# Altium schematic sheet 2_DDR3L_16bits.SchDoc: 2_DDR3L_16bits
size A3; Date: Not used; ApprovedBy: Not used; CheckedBy: Not used; Author: Not used; CompanyName: STMicroelectronics; DrawnBy: Not used; Engineer: Not used; Organization: Not used; Address1: Not used; Address2: Not used; Address3: Not used; Address4: Not used; DocumentNumber: Not used; Revision: Not used; SheetNumber: 6; SheetTotal: 7; CurrentTime: Not used; CurrentDate: Not used; Time: Not used; DocumentFullPathAndName: Not used; DocumentName: Not used; ModifiedDate: Not used; ImagePath: Not used; ProjectName: Not used; Application_BuildNumber: Not used
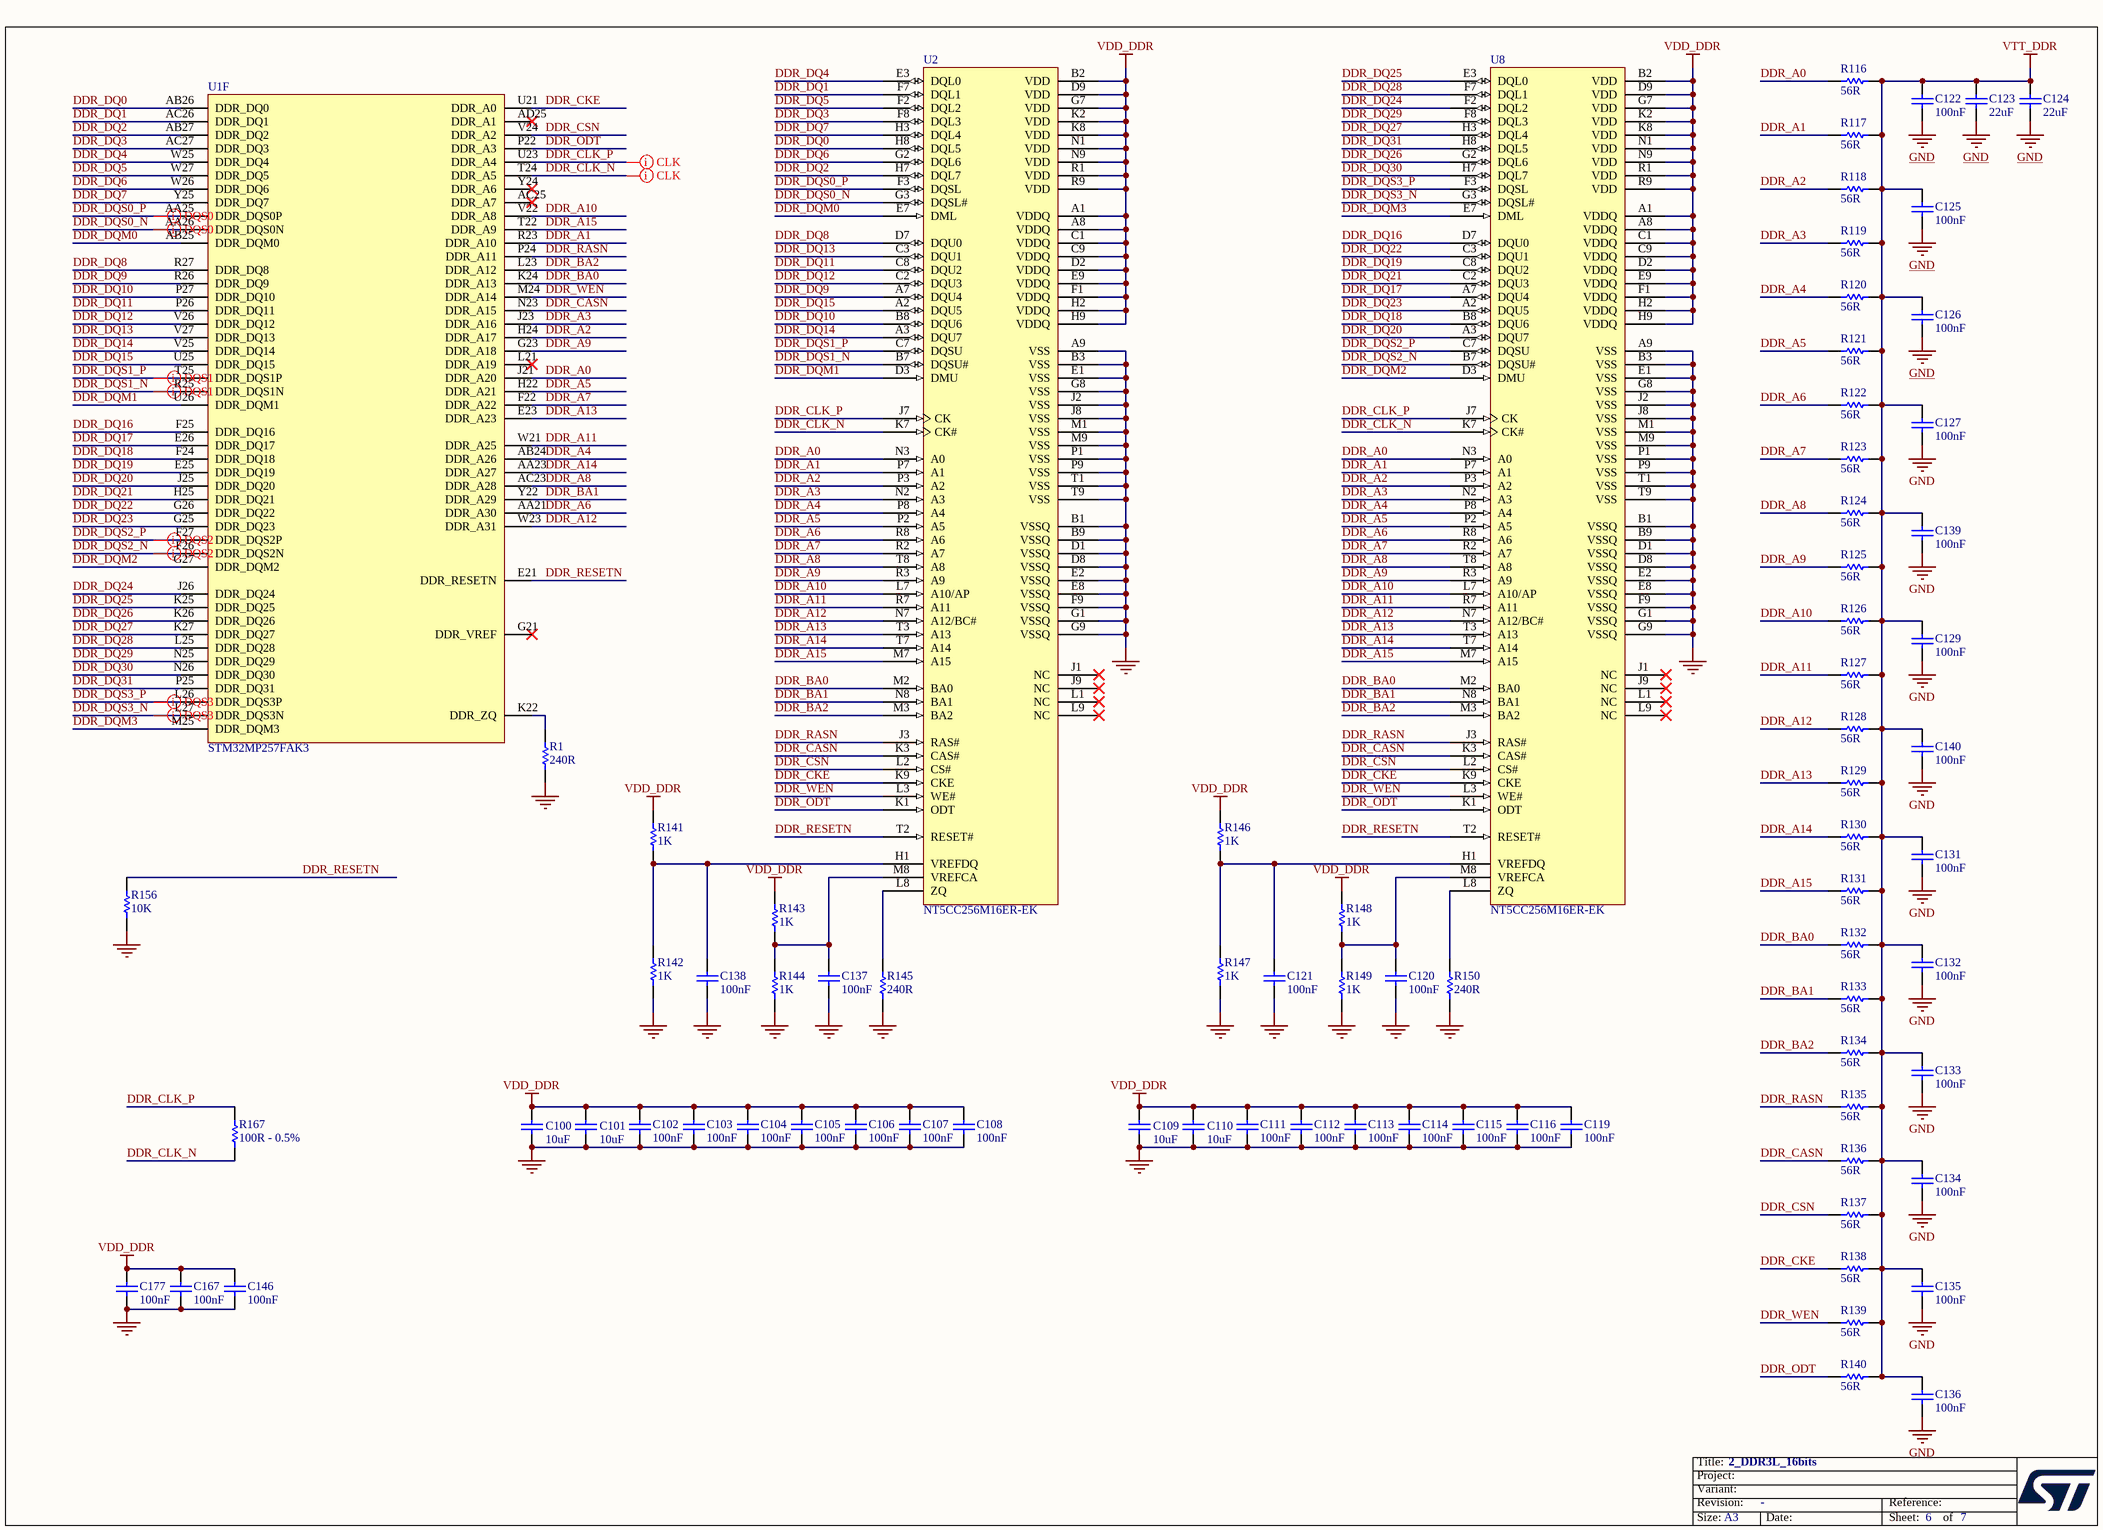
[diagram p0: 2_DDR3L_16bits.SchDoc]

## Parts
C100  value 10uF  [C0603]  (hidden comment: Capacitor)
C101  value 10uF  [C0603]  (hidden comment: Capacitor)
C102  value 100nF  [C0402]  (hidden comment: Capacitor)
C103  value 100nF  [C0402]  (hidden comment: Capacitor)
C104  value 100nF  [C0402]  (hidden comment: Capacitor)
C105  value 100nF  [C0402]  (hidden comment: Capacitor)
C106  value 100nF  [C0402]  (hidden comment: Capacitor)
C107  value 100nF  [C0402]  (hidden comment: Capacitor)
C108  value 100nF  [C0402]  (hidden comment: Capacitor)
C109  value 10uF  [C0603]  (hidden comment: Capacitor)
C110  value 10uF  [C0603]  (hidden comment: Capacitor)
C111  value 100nF  [C0402]  (hidden comment: Capacitor)
C112  value 100nF  [C0402]  (hidden comment: Capacitor)
C113  value 100nF  [C0402]  (hidden comment: Capacitor)
C114  value 100nF  [C0402]  (hidden comment: Capacitor)
C115  value 100nF  [C0402]  (hidden comment: Capacitor)
C116  value 100nF  [C0402]  (hidden comment: Capacitor)
C119  value 100nF  [C0402]  (hidden comment: Capacitor)
C120  value 100nF  [C0402]  (hidden comment: Capacitor)
C121  value 100nF  [C0402]  (hidden comment: Capacitor)
C122  value 100nF  [C0402]  (hidden comment: Capacitor)
C123  value 22uF  [C0603]  (hidden comment: Capacitor)
C124  value 22uF  [C0603]  (hidden comment: Capacitor)
C125  value 100nF  [C0402]  (hidden comment: Capacitor)
C126  value 100nF  [C0402]  (hidden comment: Capacitor)
C127  value 100nF  [C0402]  (hidden comment: Capacitor)
C129  value 100nF  [C0402]  (hidden comment: Capacitor)
C131  value 100nF  [C0402]  (hidden comment: Capacitor)
C132  value 100nF  [C0402]  (hidden comment: Capacitor)
C133  value 100nF  [C0402]  (hidden comment: Capacitor)
C134  value 100nF  [C0402]  (hidden comment: Capacitor)
C135  value 100nF  [C0402]  (hidden comment: Capacitor)
C136  value 100nF  [C0402]  (hidden comment: Capacitor)
C137  value 100nF  [C0402]  (hidden comment: Capacitor)
C138  value 100nF  [C0402]  (hidden comment: Capacitor)
C139  value 100nF  [C0402]  (hidden comment: Capacitor)
C140  value 100nF  [C0402]  (hidden comment: Capacitor)
C146  value 100nF  [C0402]  (hidden comment: Capacitor)
C167  value 100nF  [C0402]  (hidden comment: Capacitor)
C177  value 100nF  [C0402]  (hidden comment: Capacitor)
R1  value 240R  [R0201_H0P23]  (hidden comment: Resistor)
R116  value 56R  [R0402]  (hidden comment: Resistor)
R117  value 56R  [R0402]  (hidden comment: Resistor)
R118  value 56R  [R0402]  (hidden comment: Resistor)
R119  value 56R  [R0402]  (hidden comment: Resistor)
R120  value 56R  [R0402]  (hidden comment: Resistor)
R121  value 56R  [R0402]  (hidden comment: Resistor)
R122  value 56R  [R0402]  (hidden comment: Resistor)
R123  value 56R  [R0402]  (hidden comment: Resistor)
R124  value 56R  [R0402]  (hidden comment: Resistor)
R125  value 56R  [R0402]  (hidden comment: Resistor)
R126  value 56R  [R0402]  (hidden comment: Resistor)
R127  value 56R  [R0402]  (hidden comment: Resistor)
R128  value 56R  [R0402]  (hidden comment: Resistor)
R129  value 56R  [R0402]  (hidden comment: Resistor)
R130  value 56R  [R0402]  (hidden comment: Resistor)
R131  value 56R  [R0402]  (hidden comment: Resistor)
R132  value 56R  [R0402]  (hidden comment: Resistor)
R133  value 56R  [R0402]  (hidden comment: Resistor)
R134  value 56R  [R0402]  (hidden comment: Resistor)
R135  value 56R  [R0402]  (hidden comment: Resistor)
R136  value 56R  [R0402]  (hidden comment: Resistor)
R137  value 56R  [R0402]  (hidden comment: Resistor)
R138  value 56R  [R0402]  (hidden comment: Resistor)
R139  value 56R  [R0402]  (hidden comment: Resistor)
R140  value 56R  [R0402]  (hidden comment: Resistor)
R141  value 1K  [R0402]  (hidden comment: Resistor)
R142  value 1K  [R0402]  (hidden comment: Resistor)
R143  value 1K  [R0402]  (hidden comment: Resistor)
R144  value 1K  [R0402]  (hidden comment: Resistor)
R145  value 240R  [R0402]  (hidden comment: Resistor)
R146  value 1K  [R0402]  (hidden comment: Resistor)
R147  value 1K  [R0402]  (hidden comment: Resistor)
R148  value 1K  [R0402]  (hidden comment: Resistor)
R149  value 1K  [R0402]  (hidden comment: Resistor)
R150  value 240R  [R0402]  (hidden comment: Resistor)
R156  value 10K  [R0402]  (hidden comment: Resistor)
R167  value 100R - 0.5%  [R0402]  (hidden comment: Resistor)
U1  STM32MP257FAK3  [ICC_TFBGA424_14X14_P050_H1P20_CODE-B0A2]  (part F of 9)
U2  NT5CC256M16ER-EK  [ICC_VFBGA96_9x13_P080]
U8  NT5CC256M16ER-EK  [ICC_VFBGA96_9x13_P080]

## Nets
GND: C100.1 C101.1 C102.1 C103.1 C104.1 C105.1 C106.1 C107.1 C108.1 C109.1 C110.1 C111.1 C112.1 C113.1 C114.1 C115.1 C116.1 C119.1 C120.1 C121.1 C122.1 C123.1 C124.1 C125.1 C126.1 C127.1 C129.1 C131.1 C132.1 C133.1 C134.1 C135.1 C136.1 C137.1 C138.1 C139.1 C140.1 C146.1 C167.1 C177.1 R1.1 R142.1 R144.1 R145.1 R147.1 R149.1 R150.1 R156.1 U2.A9(VSS) U2.B1(VSSQ) U2.B3(VSS) U2.B9(VSSQ) U2.D1(VSSQ) U2.D8(VSSQ) U2.E1(VSS) U2.E2(VSSQ) U2.E8(VSSQ) U2.F9(VSSQ) U2.G1(VSSQ) U2.G8(VSS) U2.G9(VSSQ) U2.J2(VSS) U2.J8(VSS) U2.M1(VSS) U2.M9(VSS) U2.P1(VSS) U2.P9(VSS) U2.T1(VSS) U2.T9(VSS) U8.A9(VSS) U8.B1(VSSQ) U8.B3(VSS) U8.B9(VSSQ) U8.D1(VSSQ) U8.D8(VSSQ) U8.E1(VSS) U8.E2(VSSQ) U8.E8(VSSQ) U8.F9(VSSQ) U8.G1(VSSQ) U8.G8(VSS) U8.G9(VSSQ) U8.J2(VSS) U8.J8(VSS) U8.M1(VSS) U8.M9(VSS) U8.P1(VSS) U8.P9(VSS) U8.T1(VSS) U8.T9(VSS)
VDD_DDR: C100.2 C101.2 C102.2 C103.2 C104.2 C105.2 C106.2 C107.2 C108.2 C109.2 C110.2 C111.2 C112.2 C113.2 C114.2 C115.2 C116.2 C119.2 C146.2 C167.2 C177.2 R141.2 R143.2 R146.2 R148.2 U2.A1(VDDQ) U2.A8(VDDQ) U2.B2(VDD) U2.C1(VDDQ) U2.C9(VDDQ) U2.D2(VDDQ) U2.D9(VDD) U2.E9(VDDQ) U2.F1(VDDQ) U2.G7(VDD) U2.H2(VDDQ) U2.H9(VDDQ) U2.K2(VDD) U2.K8(VDD) U2.N1(VDD) U2.N9(VDD) U2.R1(VDD) U2.R9(VDD) U8.A1(VDDQ) U8.A8(VDDQ) U8.B2(VDD) U8.C1(VDDQ) U8.C9(VDDQ) U8.D2(VDDQ) U8.D9(VDD) U8.E9(VDDQ) U8.F1(VDDQ) U8.G7(VDD) U8.H2(VDDQ) U8.H9(VDDQ) U8.K2(VDD) U8.K8(VDD) U8.N1(VDD) U8.N9(VDD) U8.R1(VDD) U8.R9(VDD)
VTT_DDR: C122.2 C123.2 C124.2 C125.2 C126.2 C127.2 C129.2 C131.2 C132.2 C133.2 C134.2 C135.2 C136.2 C139.2 C140.2 R116.2 R117.2 R118.2 R119.2 R120.2 R121.2 R122.2 R123.2 R124.2 R125.2 R126.2 R127.2 R128.2 R129.2 R130.2 R131.2 R132.2 R133.2 R134.2 R135.2 R136.2 R137.2 R138.2 R139.2 R140.2
DDR_A0: R116.1 U1.J21(DDR_A20) U2.N3(A0) U8.N3(A0)
DDR_A1: R117.1 U1.R23(DDR_A10) U2.P7(A1) U8.P7(A1)
DDR_A2: R118.1 U1.H24(DDR_A17) U2.P3(A2) U8.P3(A2)
DDR_A3: R119.1 U1.J23(DDR_A16) U2.N2(A3) U8.N2(A3)
DDR_A4: R120.1 U1.AB24(DDR_A26) U2.P8(A4) U8.P8(A4)
DDR_A5: R121.1 U1.H22(DDR_A21) U2.P2(A5) U8.P2(A5)
DDR_A6: R122.1 U1.AA21(DDR_A30) U2.R8(A6) U8.R8(A6)
DDR_A7: R123.1 U1.F22(DDR_A22) U2.R2(A7) U8.R2(A7)
DDR_A8: R124.1 U1.AC23(DDR_A28) U2.T8(A8) U8.T8(A8)
DDR_A9: R125.1 U1.G23(DDR_A18) U2.R3(A9) U8.R3(A9)
DDR_A10: R126.1 U1.V22(DDR_A8) U2.L7(A10/AP) U8.L7(A10/AP)
DDR_A11: R127.1 U1.W21(DDR_A25) U2.R7(A11) U8.R7(A11)
DDR_A12: R128.1 U1.W23(DDR_A31) U2.N7(A12/BC#) U8.N7(A12/BC#)
DDR_A13: R129.1 U1.E23(DDR_A23) U2.T3(A13) U8.T3(A13)
DDR_A14: R130.1 U1.AA23(DDR_A27) U2.T7(A14) U8.T7(A14)
DDR_A15: R131.1 U1.T22(DDR_A9) U2.M7(A15) U8.M7(A15)
DDR_BA0: R132.1 U1.K24(DDR_A13) U2.M2(BA0) U8.M2(BA0)
DDR_BA1: R133.1 U1.Y22(DDR_A29) U2.N8(BA1) U8.N8(BA1)
DDR_BA2: R134.1 U1.L23(DDR_A12) U2.M3(BA2) U8.M3(BA2)
DDR_CASN: R136.1 U1.N23(DDR_A15) U2.K3(CAS#) U8.K3(CAS#)
DDR_CKE: R138.1 U1.U21(DDR_A0) U2.K9(CKE) U8.K9(CKE)
DDR_CLK_N: R167.2 U1.T24(DDR_A5) U2.K7(CK#) U8.K7(CK#)
DDR_CLK_P: R167.1 U1.U23(DDR_A4) U2.J7(CK) U8.J7(CK)
DDR_CSN: R137.1 U1.V24(DDR_A2) U2.L2(CS#) U8.L2(CS#)
DDR_DQ0: U1.AB26(DDR_DQ0) U2.H8(DQL5)
DDR_DQ1: U1.AC26(DDR_DQ1) U2.F7(DQL1)
DDR_DQ2: U1.AB27(DDR_DQ2) U2.H7(DQL7)
DDR_DQ3: U1.AC27(DDR_DQ3) U2.F8(DQL3)
DDR_DQ4: U1.W25(DDR_DQ4) U2.E3(DQL0)
DDR_DQ5: U1.W27(DDR_DQ5) U2.F2(DQL2)
DDR_DQ6: U1.W26(DDR_DQ6) U2.G2(DQL6)
DDR_DQ7: U1.Y25(DDR_DQ7) U2.H3(DQL4)
DDR_DQ8: U1.R27(DDR_DQ8) U2.D7(DQU0)
DDR_DQ9: U1.R26(DDR_DQ9) U2.A7(DQU4)
DDR_DQ10: U1.P27(DDR_DQ10) U2.B8(DQU6)
DDR_DQ11: U1.P26(DDR_DQ11) U2.C8(DQU2)
DDR_DQ12: U1.V26(DDR_DQ12) U2.C2(DQU3)
DDR_DQ13: U1.V27(DDR_DQ13) U2.C3(DQU1)
DDR_DQ14: U1.V25(DDR_DQ14) U2.A3(DQU7)
DDR_DQ15: U1.U25(DDR_DQ15) U2.A2(DQU5)
DDR_DQ16: U1.F25(DDR_DQ16) U8.D7(DQU0)
DDR_DQ17: U1.E26(DDR_DQ17) U8.A7(DQU4)
DDR_DQ18: U1.F24(DDR_DQ18) U8.B8(DQU6)
DDR_DQ19: U1.E25(DDR_DQ19) U8.C8(DQU2)
DDR_DQ20: U1.J25(DDR_DQ20) U8.A3(DQU7)
DDR_DQ21: U1.H25(DDR_DQ21) U8.C2(DQU3)
DDR_DQ22: U1.G26(DDR_DQ22) U8.C3(DQU1)
DDR_DQ23: U1.G25(DDR_DQ23) U8.A2(DQU5)
DDR_DQ24: U1.J26(DDR_DQ24) U8.F2(DQL2)
DDR_DQ25: U1.K25(DDR_DQ25) U8.E3(DQL0)
DDR_DQ26: U1.K26(DDR_DQ26) U8.G2(DQL6)
DDR_DQ27: U1.K27(DDR_DQ27) U8.H3(DQL4)
DDR_DQ28: U1.L25(DDR_DQ28) U8.F7(DQL1)
DDR_DQ29: U1.N25(DDR_DQ29) U8.F8(DQL3)
DDR_DQ30: U1.N26(DDR_DQ30) U8.H7(DQL7)
DDR_DQ31: U1.P25(DDR_DQ31) U8.H8(DQL5)
DDR_DQM0: U1.AB25(DDR_DQM0) U2.E7(DML)
DDR_DQM1: U1.U26(DDR_DQM1) U2.D3(DMU)
DDR_DQM2: U1.G27(DDR_DQM2) U8.D3(DMU)
DDR_DQM3: U1.M25(DDR_DQM3) U8.E7(DML)
DDR_DQS0_N: U1.AA26(DDR_DQS0N) U2.G3(DQSL#)
DDR_DQS0_P: U1.AA25(DDR_DQS0P) U2.F3(DQSL)
DDR_DQS1_N: U1.R25(DDR_DQS1N) U2.B7(DQSU#)
DDR_DQS1_P: U1.T25(DDR_DQS1P) U2.C7(DQSU)
DDR_DQS2_N: U1.F26(DDR_DQS2N) U8.B7(DQSU#)
DDR_DQS2_P: U1.F27(DDR_DQS2P) U8.C7(DQSU)
DDR_DQS3_N: U1.L27(DDR_DQS3N) U8.G3(DQSL#)
DDR_DQS3_P: U1.L26(DDR_DQS3P) U8.F3(DQSL)
DDR_ODT: R140.1 U1.P22(DDR_A3) U2.K1(ODT) U8.K1(ODT)
DDR_RASN: R135.1 U1.P24(DDR_A11) U2.J3(RAS#) U8.J3(RAS#)
DDR_RESETN: R156.2 U1.E21(DDR_RESETN) U2.T2(RESET#) U8.T2(RESET#)
DDR_WEN: R139.1 U1.M24(DDR_A14) U2.L3(WE#) U8.L3(WE#)
NetC120_2: C120.2 R148.1 R149.2 U8.M8(VREFCA)
NetC121_2: C121.2 R146.1 R147.2 U8.H1(VREFDQ)
NetC137_2: C137.2 R143.1 R144.2 U2.M8(VREFCA)
NetC138_2: C138.2 R141.1 R142.2 U2.H1(VREFDQ)
NetR1_2: R1.2 U1.K22(DDR_ZQ)
NetR145_2: R145.2 U2.L8(ZQ)
NetR150_2: R150.2 U8.L8(ZQ)

Not connected (* = marked no-connect by the designer): U1 AC25(DDR_A7)* AD25(DDR_A1)* G21(DDR_VREF)* L21(DDR_A19)* Y24(DDR_A6)*; U2 J1(NC)* J9(NC)* L1(NC)* L9(NC)*; U8 J1(NC)* J9(NC)* L1(NC)* L9(NC)*

## Layout directives
differential pair: DDR_CLK_N, DDR_CLK_P, DDR_DQS0_N, DDR_DQS0_P, DDR_DQS1_N, DDR_DQS1_P, DDR_DQS2_N, DDR_DQS2_P, DDR_DQS3_N, DDR_DQS3_P

## Notes on the sheet
- Title:
- Project:
- Size:
- Revision:
- Variant:
- A3
- -
- Date:
- Reference:
- Sheet:
- of

## Library data of the parts
C100 C101 C109 C110 = MCD-00099: Capacitor, MLCC, 10uF, 10V, X5R, +/-10%, 0603, T=0.8mm; Manufacturer_Part_Number: GRM188R61A106KE69D; Manufacturer: MURATA; Part_Preference: Recommended; Order_Code_RS: 170-6168; Internal_Part_Number: MCD-00099; Status: Released; Part_Type: Capacitor; Package: 0603; ComponentLink1URL: http://tunmcdsvn.tun.st.com/Component_Documentation_Library/Trunk/Capacitor/MURATA_GRM_Series; Order_Code_Digikey: 490-10474-1-ND; Order_Code_Farnell: 2494233; Alternate_Manufacturer: N/A; Alternate_Manufacturer_Part_Number: N/A
C102-C108 C111-C116 C119-C122 C125-C127 C129 C131-C140 C146 C167 C177 = MCD-00006: Capacitor, MLCC, 100nF, 16V, X7R, +/-10%, 0402, T=0.5mm; Part_Preference: Recommended; Manufacturer: YAGEO; Manufacturer_Part_Number: CC0402KRX7R7BB104; Alternate_Manufacturer: MURATA; Alternate_Manufacturer_Part_Number: GCM155R71C104KA55D; Order_Code_RS: 616-9701; Internal_Part_Number: MCD-00006; Status: Released; Part_Type: Capacitor; Package: C0402; ComponentLink1Description: Datasheet; ComponentLink1URL: http://tunmcdsvn.tun.st.com/Component_Datasheet_Library/Trunk/Capacitors/Yageo_Multilayer_Capacitor_X7R_series_100pF_to_22uF; Order_Code_Digikey: 311-1338-1-ND; Order_Code_Farnell: 9402047
C123 C124 = MCD-00100: Capacitor, MLCC, 22uF, 6V3, X5R, +/-20%, 0603, T=0,8mm; Part_Preference: Recommended; Manufacturer: MURATA; Manufacturer_Part_Number: GRM188R60J226MEA0J; Internal_Part_Number: MCD-00100; Status: Released; Part_Type: Capacitor; Package: C0603; ComponentLink1Description: Datasheet; ComponentLink1URL: http://tunmcdsvn.tun.st.com/Component_Datasheet_Library/Trunk/Capacitors/Murata_Capacitor_GR_series; Order_Code_Digikey: 490-7612-2-ND; Order_Code_Farnell: N/A; Order_Code_RS: N/A
R1 = MCD-02253: Resistor, 240R, 0201, +/-1%, 1/20W; Part_Preference: Recommended; Manufacturer: YAGEO; Manufacturer_Part_Number: RC0201FR-07240RL; Component_Country_Of_Origin: China; ID: 4353; ShowFields: YES; Internal_Part_Number: MCD-02253; Status: Checked; Part_Type: Resistor; Alternate_Manufacturer: N/A; Alternate_Manufacturer_Part_Number: N/A; Package: 0201; ComponentLink1URL: http://tunmcdsvn.tun.st.com/Component_Datasheet_Library/Trunk/Resistors/Yageo_Resistor_RC0201-series; Order_Code_Digikey: YAG2528CT-ND; Order_Code_Farnell: N/A; Order_Code_RS: N/A
R116-R140 = MCD-00054: Resistor, 56R, 0402, +/-1%, 1/16W; Part_Preference: Recommended; Manufacturer: YAGEO; Manufacturer_Part_Number: RC0402FR-0756RL; Internal_Part_Number: MCD-00054; Status: Released; Part_Type: Resistor; Package: 0402; ComponentLink1URL: http://tunmcdsvn.tun.st.com/Component_Documentation_Library/Trunk/Resistor/YAGEO_RC_L_Series; Order_Code_Digikey: 311-56.0LRCT-ND; Order_Code_Farnell: 9239081; Order_Code_RS: N/A; Alternate_Manufacturer: N/A; Alternate_Manufacturer_Part_Number: N/A
R141-R144 R146-R149 = MCD-00061: Resistor, 1K, 0402, +/-1%,1/16W; Part_Preference: Recommended; Manufacturer: YAGEO; Manufacturer_Part_Number: RC0402FR-071KL; Order_Code_RS: 9239235; Component_Country_Of_Origin: China; ShowFields: YES; ID: 2532; Internal_Part_Number: MCD-00061; Status: Released; Part_Type: Resistor; Package: 0402; ComponentLink1URL: http://tunmcdsvn.tun.st.com/Component_Documentation_Library/Trunk/Resistor/YAGEO_RC_L_Series; Order_Code_Digikey: 311-1.00KLRCT-ND; Order_Code_Farnell: 9239235
R145 R150 = MCD-00120: Resistor,240R,0402,1%,1/16W; Part_Preference: Recommended; Manufacturer: YAGEO; Manufacturer_Part_Number: RC0402FR-07240RL; Internal_Part_Number: MCD-00120; Status: Released; Part_Type: Resistor; Package: R0402; ComponentLink1Description: Datasheet; ComponentLink1URL: http://tunmcdsvn.tun.st.com/Component_Datasheet_Library/Trunk/Resistors/Yageo_Resistor_RC0402-series; Order_Code_Digikey: 311-240LRCT-ND; Order_Code_Farnell: 1458766; Order_Code_RS: N/A
R156 = MCD-00053: Resistor,10K,0402,1%,1/16W; BMS_Part_Number: 9131590; Part_Preference: Recommended; Manufacturer: YAGEO; Manufacturer_Part_Number: RC0402FR-0710KL; Internal_Part_Number: MCD-00053; Status: Released; Part_Type: Resistor; Package: R0402; ComponentLink1Description: Datasheet; ComponentLink1URL: http://tunmcdsvn.tun.st.com/Component_Datasheet_Library/Trunk/Resistors/Yageo_Resistor_RC0402-series; Order_Code_Digikey: 311-10.0KLRCT-ND; Order_Code_Farnell: 9239359; Order_Code_RS: N/A
R167 = MCD-01819: Resistor,100R,0402,0,5%,1/16W,±100ppm/°C; Part_Preference: Recommended; Manufacturer: YAGEO; Manufacturer_Part_Number: RC0402DR-07100RL; Internal_Part_Number: MCD-01819; Status: Released; Part_Type: Resistor; Package: R0402; ComponentLink1Description: Datasheet; ComponentLink1URL: http://tunmcdsvn.tun.st.com/Component_Datasheet_Library/Trunk/Resistors/Yageo_Resistor_RC0603-series/Yageo_Resistor_RC_Group_51_RoHS.pdf; Order_Code_Digikey: RC0402DR-07100RL-ND; Order_Code_Farnell: N/A; Order_Code_RS: N/A
U1 = MCD-03375: MPU , 2xCortex-A35@1.5GHz, Cortex-M33@400MHz, TFBGA 14x14, pitch 0.5, 648KB SRAM, With Crypto; Part_Type: IC; Part_Preference: Recommended; Manufacturer: STMICROELECTRONICS; Component_Country_Of_Origin: Unknown; ShowFields: YES; ID: 5491; Value: STM32MP257FAK3; Internal_Part_Number: MCD-03375; Status: Checked; Manufacturer_Part_Number: STM32MP257FAK3; Package: TFBGA; ComponentLink1URL: http://tunmcdsvn.tun.st.com/Component_Documentation_Library/Trunk/IC/STMICROELECTRONICS_STM32MP257FAK3; Order_Code_Digikey: N/A; Order_Code_Farnell: N/A; Order_Code_RS: N/A
U2 U8 = MCD-01811: Memory,DDR3L,4Gb,256Mbx16,933Mhz,1V35,TFBGA; BMS_Part_Number: 9171435; Part_Type: IC; Part_Preference: Recommended; Manufacturer: NANYA; Internal_Part_Number: MCD-01811; Value: NT5CC256M16ER-EK; Status: Released; Manufacturer_Part_Number: NT5CC256M16ER-EK; ComponentLink1URL: http://tunmcdsvn.tun.st.com/Component_Datasheet_Library/Trunk/IC/Nanya_DDR3_NT5CC256M16ER-EK